# Altium project Environment_Monitor.PrjPcb
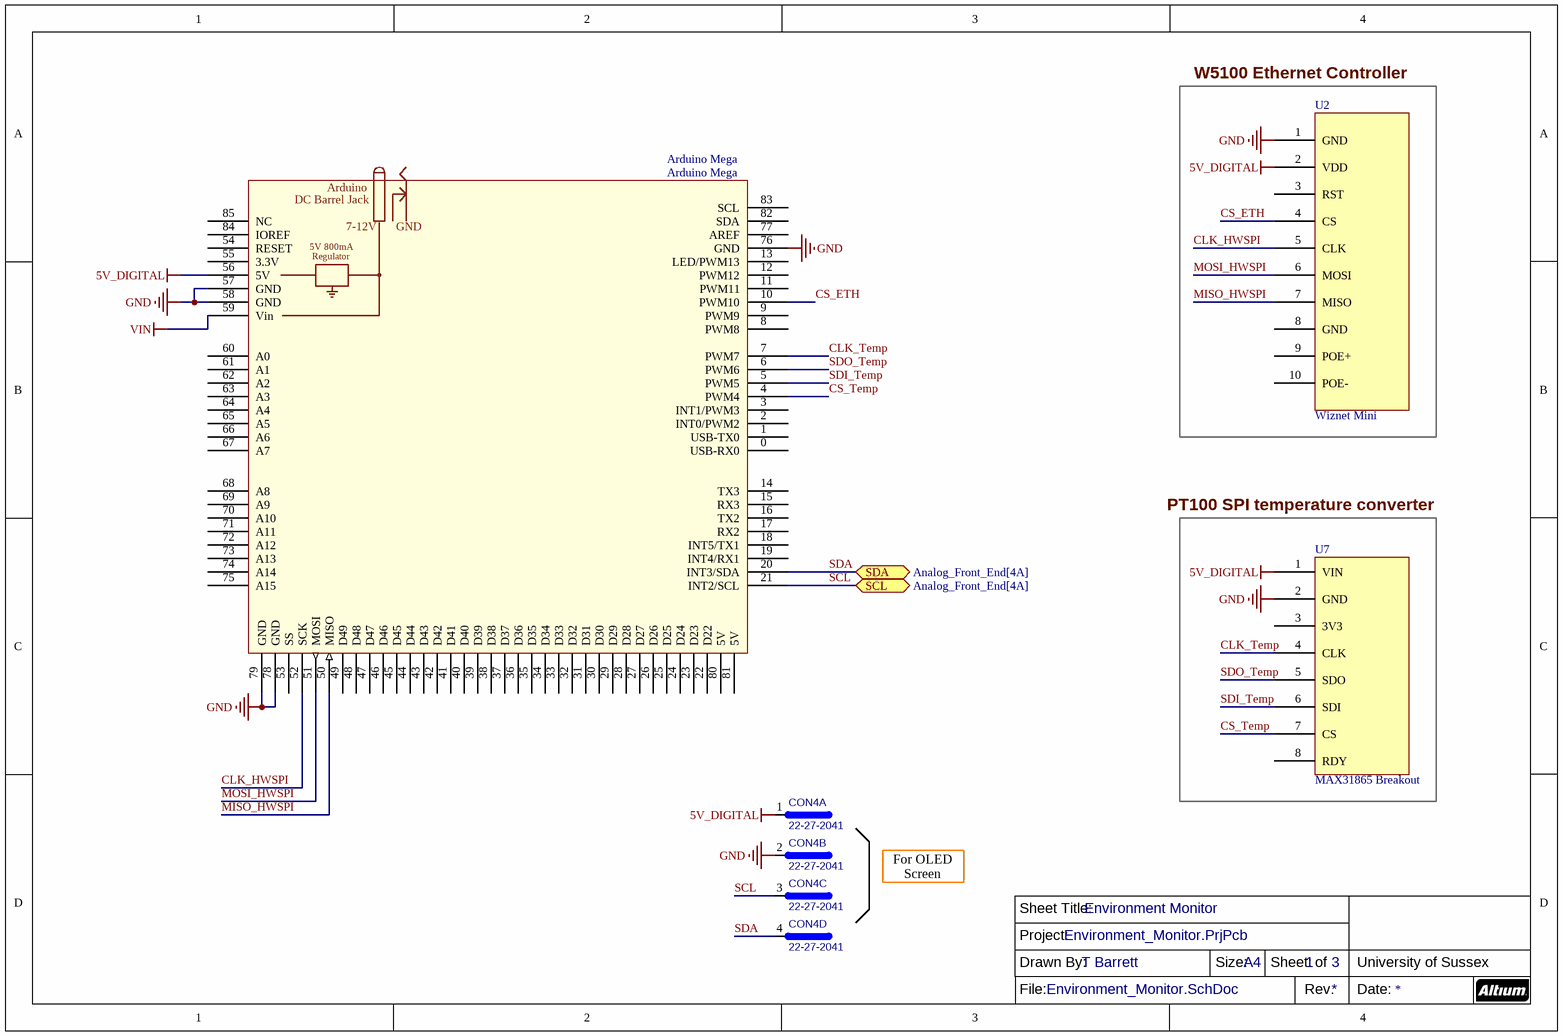
[diagram p0: Environment_Monitor.SchDoc]
3 sheets, 35 parts. Net scope: flat (ports and power ports of the same name join across sheets).
Board file: Environment_Monitor.PcbDoc
Sheets:
  Environment_Monitor.SchDoc
  Analog_Front_End.SchDoc
  Analog_Front_End_Characterisation.SchDoc

## Sheet Environment_Monitor.SchDoc: Environment Monitor
size A4; DrawnBy: T Barrett; SheetNumber: 1; SheetTotal: 3

### Parts
Arduino_Mega  Arduino Mega  [Arduino Mega]
CON4  22-27-2041  [22-27-2041]  (parts A,B,C,D of 4)
U2  Wiznet Mini  [Wiznet Mini W5100 Ethernet Breakout Board]
U7  MAX31865 Breakout  [MAX31865 Breakout]

### Blocks framed on the sheet
W5100 Ethernet Controller: U2
PT100 SPI temperature converter: U7

### Ports
SCL (bidir, see Analog_Front_End[4A]), SDA (bidir, see Analog_Front_End[4A])

### Nets
5V_DIGITAL: Arduino_Mega.56(5V) CON4.1 U2.2(VDD) U7.1(VIN)
GND: Arduino_Mega.57(GND) Arduino_Mega.58(GND) Arduino_Mega.76(GND) Arduino_Mega.78(GND) Arduino_Mega.79(GND) CON4.2 U2.1(GND) U7.2(GND)
VIN: Arduino_Mega.59(Vin)
CLK_HWSPI: Arduino_Mega.52(SCK) U2.5(CLK)
CLK_Temp: Arduino_Mega.7(PWM7) U7.4(CLK)
CS_ETH: Arduino_Mega.10(PWM10) U2.4(CS)
CS_Temp: Arduino_Mega.4(PWM4) U7.7(CS)
MISO_HWSPI: Arduino_Mega.50(MISO) U2.7(MISO)
MOSI_HWSPI: Arduino_Mega.51(MOSI) U2.6(MOSI)
SCL: Arduino_Mega.21(INT2/SCL) CON4.3 ; port SCL
SDA: Arduino_Mega.20(INT3/SDA) CON4.4 ; port SDA
SDI_Temp: Arduino_Mega.5(PWM5) U7.6(SDI)
SDO_Temp: Arduino_Mega.6(PWM6) U7.5(SDO)

Not connected (* = marked no-connect by the designer): Arduino_Mega 0(USB-RX0) 1(USB-TX0) 2(INT0/PWM2) 3(INT1/PWM3) 8(PWM8) 9(PWM9) 11(PWM11) 12(PWM12) 13(LED/PWM13) 14(TX3) 15(RX3) 16(TX2) 17(RX2) 18(INT5/TX1) 19(INT4/RX1) 22(D22) 23(D23) 24(D24) 25(D25) 26(D26) 27(D27) 28(D28) 29(D29) 30(D30) 31(D31) 32(D32) 33(D33) 34(D34) 35(D35) 36(D36) 37(D37) 38(D38) 39(D39) 40(D40) 41(D41) 42(D42) 43(D43) 44(D44) 45(D45) 46(D46) 47(D47) 48(D48) 49(D49) 53(SS) 54(RESET) 55(3.3V) 60(A0) 61(A1) 62(A2) 63(A3) 64(A4) 65(A5) 66(A6) 67(A7) 68(A8) 69(A9) 70(A10) 71(A11) 72(A12) 73(A13) 74(A14) 75(A15) 77(AREF) 80(5V) 81(5V) 82(SDA) 83(SCL) 84(IOREF) 85(NC); U2 3(RST) 8(GND) 9(POE+) 10(POE-); U7 3(3V3) 8(RDY)

### Notes on the sheet
- For OLED Screen
- Sheet Title:
- Drawn By:
- Project:
- Size:
- A4
- Sheet:
- of
- University of Sussex
- File:
- Rev.
- Date:
- (in symbol Arduino Mega) Arduino; DC Barrel Jack; 7-12V; 5V 800mA; Regulator

### Library data of the parts
U2 = Wiznet Mini: Wiznet W5100 Ethernet Breakout Board
U7 = MAX31865 Breakout: MAX31865 PT100 Amplifier Breakout
CON4 = 22-27-2041: Value: *

## Sheet Analog_Front_End.SchDoc: Analog Front End
size A4; DrawnBy: T. Barrett; SheetNumber: 2; SheetTotal: 3
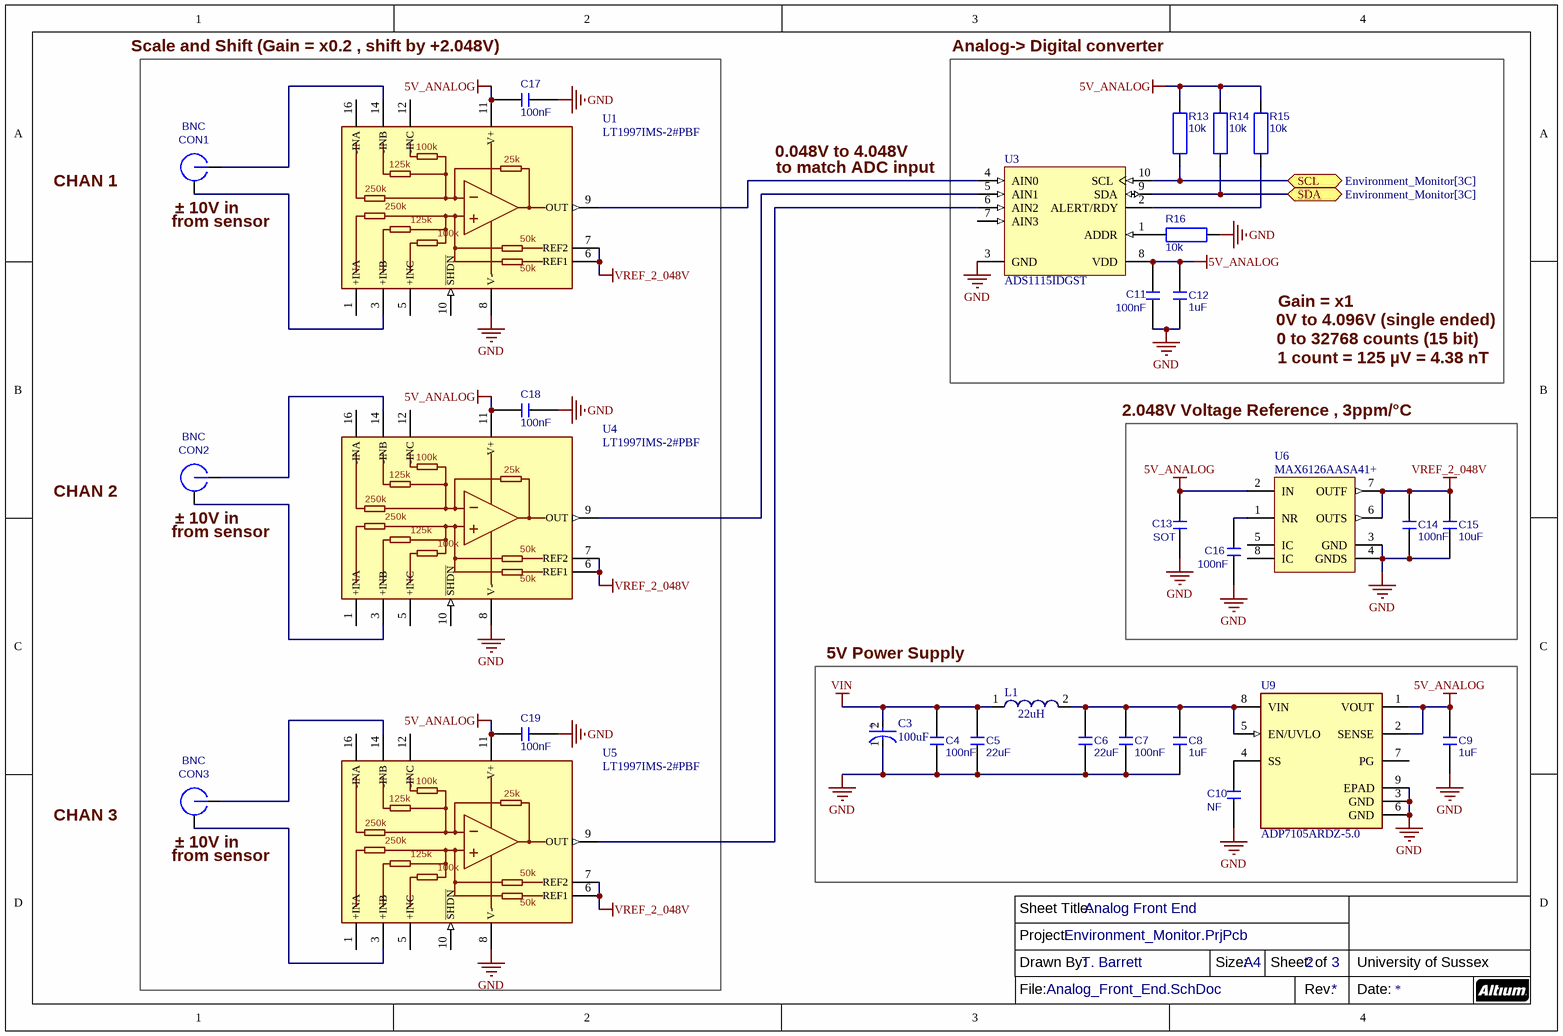
[diagram p1: Analog_Front_End.SchDoc]

### Parts
C3  100uF  [FP-865080657017-MFG]
C4  value 100nF  [CAPACITOR SMD 1206]  (hidden comment: Capacitor SMD 1206)
C5  value 22uF  [CAPACITOR SMD 1206]  (hidden comment: Capacitor SMD 1206)
C6  value 22uF  [CAPACITOR SMD 1206]  (hidden comment: Capacitor SMD 1206)
C7  value 100nF  [CAPACITOR SMD 1206]  (hidden comment: Capacitor SMD 1206)
C8  value 1uF  [CAPACITOR SMD 1206]  (hidden comment: Capacitor SMD 1206)
C9  value 1uF  [CAPACITOR SMD 1206]  (hidden comment: Capacitor SMD 1206)
C10  value NF  [CAPACITOR SMD 0805]  (hidden comment: Capacitor SMD 0805)
C11  value 100nF  [CAPACITOR SMD 0805]  (hidden comment: Capacitor SMD 0805)
C12  value 1uF  [CAPACITOR SMD 1206]  (hidden comment: Capacitor SMD 1206)
C13  value SOT  [CAPACITOR SMD 1206]  (hidden comment: Capacitor SMD 1206)
C14  value 100nF  [CAPACITOR SMD 0805]  (hidden comment: Capacitor SMD 0805)
C15  value 10uF  [CAPACITOR SMD 1206]  (hidden comment: Capacitor SMD 1206)
C16  value 100nF  [CAPACITOR SMD 0805]  (hidden comment: Capacitor SMD 0805)
C17  value 100nF  [CAPACITOR SMD 0805]  (hidden comment: Capacitor SMD 0805)
C18  value 100nF  [CAPACITOR SMD 0805]  (hidden comment: Capacitor SMD 0805)
C19  value 100nF  [CAPACITOR SMD 0805]  (hidden comment: Capacitor SMD 0805)
CON1  BNC  [BNC B6252H5-NPP3G-50]
CON2  BNC  [BNC B6252H5-NPP3G-50]
CON3  BNC  [BNC B6252H5-NPP3G-50]
L1  22uH  [WE-LQS 4018]
R13  value 10k  [RESISTOR SMD 0805]  (hidden comment: Resistor SMD 0805)
R14  value 10k  [RESISTOR SMD 0805]  (hidden comment: Resistor SMD 0805)
R15  value 10k  [RESISTOR SMD 0805]  (hidden comment: Resistor SMD 0805)
R16  value 10k  [RESISTOR SMD 0805]  (hidden comment: Resistor SMD 0805)
U1  LT1997IMS-2#PBF  [MSOP-16 (12 pin variation)]
U3  ADS1115IDGST  [VSSOP 10PIN]
U4  LT1997IMS-2#PBF  [MSOP-16 (12 pin variation)]
U5  LT1997IMS-2#PBF  [MSOP-16 (12 pin variation)]
U6  MAX6126AASA41+  [SOIC_N 8-pin]
U9  ADP7105ARDZ-5.0  [NSOIC-EP-8]

### Blocks framed on the sheet
2.048V Voltage Reference , 3ppm/°C: C13-C16 U6

### Ports
SCL (bidir, see Environment_Monitor[3C]), SDA (bidir, see Environment_Monitor[3C])

### Nets
5V_ANALOG: C9.2 C11.2 C12.2 C13.2 C17.2 C18.2 C19.2 R13.2 R14.2 R15.2 U1.11(V+) U3.8(VDD) U4.11(V+) U5.11(V+) U6.2(IN) U9.1(VOUT) U9.2(SENSE)
GND: C3.1(C) C4.1 C5.1 C6.1 C7.1 C8.1 C9.1 C10.1 C11.1 C12.1 C13.1 C14.1 C15.1 C16.1 C17.1 C18.1 C19.1 R16.1 U1.8(V-) U3.3(GND) U4.8(V-) U5.8(V-) U6.3(GND) U6.4(GNDS) U9.3(GND) U9.6(GND) U9.9(EPAD)
VIN: C3.2(A) C4.2 C5.2 L1.1
VREF_2_048V: C14.2 C15.2 U1.6(REF1) U1.7(REF2) U4.6(REF1) U4.7(REF2) U5.6(REF1) U5.7(REF2) U6.6(OUTS) U6.7(OUTF)
SCL: R13.1 U3.10(SCL) ; port SCL
SDA: R14.1 U3.9(SDA) ; port SDA
NetC6_2: C6.2 C7.2 C8.2 L1.2 U9.5(EN/UVLO) U9.8(VIN)
NetC10_2: C10.2 U9.4(SS)
NetC16_2: C16.2 U6.1(NR)
NetCON1_1: CON1.1 U1.14(-INB)
NetCON1_2: CON1.2 U1.3(+INB)
NetCON2_1: CON2.1 U4.14(-INB)
NetCON2_2: CON2.2 U4.3(+INB)
NetCON3_1: CON3.1 U5.14(-INB)
NetCON3_2: CON3.2 U5.3(+INB)
NetR15_1: R15.1 U3.2(ALERT/RDY)
NetR16_2: R16.2 U3.1(ADDR)
NetU1_9: U1.9(OUT) U3.4(AIN0)
NetU3_5: U3.5(AIN1) U4.9(OUT)
NetU3_6: U3.6(AIN2) U5.9(OUT)

Not connected (* = marked no-connect by the designer): CON1 3 4; CON2 3 4; CON3 3 4; U1 1(+INA) 5(+INC) 10(~{SHDN}) 12(-INC) 16(-INA); U3 7(AIN3); U4 1(+INA) 5(+INC) 10(~{SHDN}) 12(-INC) 16(-INA); U5 1(+INA) 5(+INC) 10(~{SHDN}) 12(-INC) 16(-INA); U6 5(IC) 8(IC); U9 7(PG)

### Notes on the sheet
- (near C17) Scale and Shift (Gain = x0.2 , shift by +2.048V)
- Analog-> Digital converter
- CHAN 1
- 0.048V to 4.048V
- to match ADC input
- (near CON1) ± 10V in
- (near CON1) from sensor
- Gain = x1
- 0V to 4.096V (single ended)
- 0 to 32768 counts (15 bit)
- 1 count = 125 µV = 4.38 nT
- CHAN 2
- (near CON2) ± 10V in
- (near CON2) from sensor
- 5V Power Supply
- CHAN 3
- (near CON3) ± 10V in
- (near CON3) from sensor
- Sheet Title:
- Drawn By:
- Project:
- Size:
- A4
- Sheet:
- of
- University of Sussex
- File:
- Rev.
- Date:
- (in symbol CMP-207834-000015-1) +
- (in symbol LT1997-2) 100k; 25k; 125k; 250k; 50k

### Library data of the parts
C3 = CMP-207834-000015-1: CAP ALUM 150UF 20% 50V SMD; Polarity: Polar; Ripple Current: 600mA; Life (Hours): 2000Hour; Impedance: 250mR; Voltage Rating (DC): 50V; Capacitance: 150uF; Tolerance: 20%; Diameter: 10mm; Max Operating Temperature: 105°C; Height: 10.5mm; Height - Seated (Max): 0.413inch; Series: WCAP-ASLI; Package Quantity: 1; Voltage Rating: 50V; Packaging: Cut Tape; Case/Package: Radial; Mount: Surface Mount; Min Operating Temperature: -55°C; RoHS Compliant: Yes; Ripple Current (AC): 600mA
C4-C9 C12 C13 C15 = Capacitor SMD 1206: Ceramic chip capacitor 1206
C10 C11 C14 C16-C19 = Capacitor SMD 0805: Ceramic chip capacitor 0805
CON1-CON3 = BNC B6252H5-NPP3G-50: AMPHENOL B6252H5-NPP3G-50  RF / Coaxial Connector, BNC Coaxial, Right Angle Jack, Through Hole Right Angle, 50 ohm; Value: *
L1 = CMP-1354-00031-1: WE-LQS SMD Power Inductor, L=33 µH; Manufacturer: Wuerth Elektronik; PartNumber: 74404042330; Inductance: 33 ÂµH; ComponentLink1URL: http://www.we-online.com; ComponentLink1Description: Manufacturer URL; ComponentLink2Description: Datasheet; PackageReference: WE-LQS 4018; ComponentLink2URL: http://katalog.we-online.de/pbs/datasheet/74404042330.pdf
R13-R16 = Resistor SMD 0805: Resistor, SMD, 0805
U1 U4 U5 = LT1997-2: IC OPAMP GP 1 CIRCUIT 16MSOP; RoHS Compliant: Yes
U3 = ADS1115: TEXAS INSTRUMENTS 16-Bit ADC with Integrated Multiplexer, PGA, Comparator, Oscillator, and Reference, -40 to 125 degC, 10-pin SOP (DGS10), Green (RoHS & no Sb/Br); Sample Rate (max)(SPS): 860; SubFamily: Precision ADC (<=10MSPS); Architecture: Delta-Sigma; Digital Supply(Min)(V): 2; Resolution(Bits): 16; Digital Supply(Max)(V): 5.5; INL(Max)(+/-LSB): 1; Interface: Serial I2C; # Input Channels: 4; Eco-Plan: Green (RoHS & no Sb/Br); PackageDescription: 10-Pin Plastic Small Outline, Body 3 x 3 mm, Pitch 0.5 mm; Mounting Technology: Surface Mount; PackageReference: DGS10; DatasheetVersion: SBAS444B; ComponentLink3Description: Package Specification; ComponentLink1Description: Manufacturer URL; PartNumber: ADS1115IDGST; Manufacturer: Texas Instruments; ComponentLink3URL: http://www.ti.com/lit/ml/mpds035b/mpds035b.pdf; ComponentLink2URL: http://www.ti.com/general/docs/lit/getliterature.tsp?genericPartNumber=ADS1115&fileType=pdf; Analog Voltage AV/DD(Min)(V): 2; ComponentLink2Description: Datasheet; PackageVersion: 4073272/C, 02/2004; Analog Voltage AV/DD(Max)(V): 5.5; Code_JEDEC: MO-153; ComponentLink1URL: http://www.ti.com/
U6 = MAX6126: Ultra-High-Precision, Ultra-Low-Noise, Series Voltage Reference, 8-Pin SOIC; Manufacturer: Maxim; Output Voltage Accuracy: 0.02% Max.; Line Regulation: 60 uV/V Max.; VOUT: 4.096 V; Dropout Voltage@10 mA: 0.1 V Typ.; Packing: Tube; VIN: 4.3 to 12.6 V; Operating Temperature: -40 to 125 degC; ComponentLink3URL: http://pdfserv.maximintegrated.com/package_dwgs/21-0041.PDF; PartNumber: MAX6126AASA41+; RoHS: TRUE; ComponentLink3Description: Package Specification; ComponentLink1URL: http://www.maximintegrated.com/; Mounting Technology: Surface Mount; DatasheetVersion: Rev. 6; ComponentLink1Description: Manufacturer URL; ComponentLink2URL: http://datasheets.maximintegrated.com/en/ds/MAX6126.pdf; PackageDescription: 8-Pin Small Outline Integrated Circuit Package, Body 4.9 x 3.9 mm, Pitch 1.27 mm; ComponentLink2Description: Datasheet; PackageVersion: Rev. E
U9 = ADP7105: ANALOG DEVICES 20 V, 500 mA, Low Noise LDO Regulator; Max Supply Current: 900uA; Output Current: 500mA; Polarity: Positive; Number of Regulators: 1; Min Output Voltage: 1.22V; Dropout Voltage: 350mV; Output Voltage Accuracy: 0.8%; Power Supply Rejection Ratio (PSRR): 50dB; Input Bias Current: 10nA; Reference Voltage: 1.23V; Max Input Voltage: 20V; Min Current Limit: 625mA; Nominal Output Voltage: 5V; Min Input Voltage: 3.3V; Max Output Voltage: 19V; Output Type: Fixed; RoHS Compliant: Yes; Package Quantity: 98; Number of Pins: 8; Mount: Surface Mount; Number of Outputs: 1; Contact Plating: Tin; Quiescent Current: 900uA; Width: 4mm; Height: 1.65mm; Lead Free: Contains Lead; Accuracy: 0.8%; Max Operating Temperature: 125°C; Length: 5mm; Packaging: Rail/Tube; REACH SVHC: No SVHC; Min Operating Temperature: -40°C; Case/Package: SOIC; Output Voltage: 5V; Max Output Current: 500mA

## Sheet Analog_Front_End_Characterisation.SchDoc: Analog Front End Characterisation
size A4; DrawnBy: T. Barrett; SheetNumber: 3; SheetTotal: 3
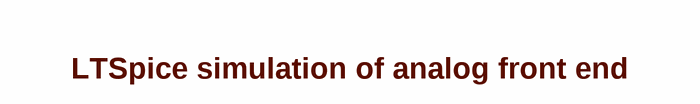
[diagram p2: Analog_Front_End_Characterisation.SchDoc]

### Notes on the sheet
- LTSpice simulation of analog front end
- Sheet Title:
- Drawn By:
- Project:
- Size:
- A4
- Sheet:
- of
- University of Sussex
- File:
- Rev.
- Date:

## Nets that join several sheets
GND: Environment_Monitor (8 pins), Analog_Front_End (27 pins)
VIN: Environment_Monitor (Arduino_Mega.59), Analog_Front_End (C3.2 C4.2 C5.2 L1.1)
SCL: Environment_Monitor (Arduino_Mega.21 CON4.3), Analog_Front_End (R13.1 U3.10)
SDA: Environment_Monitor (Arduino_Mega.20 CON4.4), Analog_Front_End (R14.1 U3.9)